# Altium schematic sheet bus-main.SchDoc: Top Level
size A4; DrawnBy: J. Reimer T. Yeung M. Au; Organization: UTAT SS; DocumentNumber: 1; Revision: 1.0; SheetNumber: 1; SheetTotal: 17
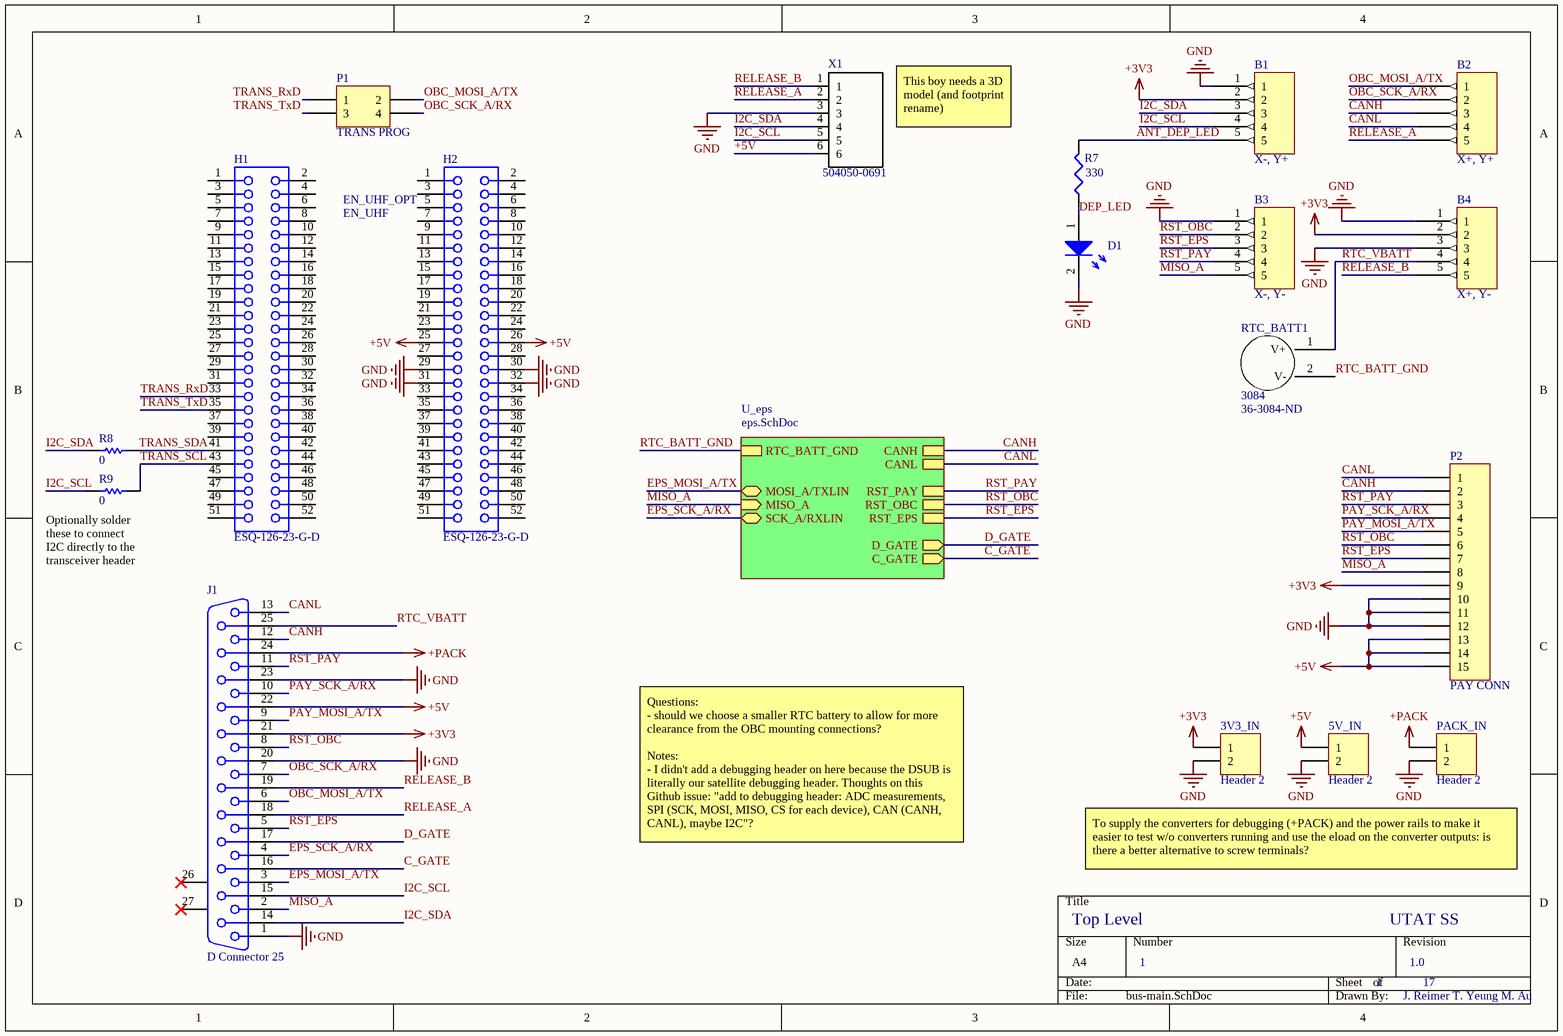
[diagram p0: bus-main.SchDoc]

## Parts
3V3_IN  Header 2  [CON2_SCREW_5.00MM_691102710002]
5V_IN  Header 2  [CON2_SCREW_5.00MM_691102710002]
B1  X-, Y+  [70AAJ-5-M0-ND]
B2  X+, Y+  [70AAJ-5-M0-ND]
B3  X-, Y-  [70AAJ-5-M0-ND]
B4  X+, Y-  [70AAJ-5-M0-ND]
D1  (no value)  [LED0603]
H1  ESQ-126-23-G-D  [SSW-126-01-G-D]
H2  ESQ-126-23-G-D  [SSW-126-01-G-D]
J1  D Connector 25  [Mini DSub Connector]
P1  TRANS PROG  [HDR2X2]
P2  PAY CONN  [DF13A-15P-1.25H(21)]
PACK_IN  Header 2  [CON2_SCREW_5.00MM_691102710002]
R7  330  [RES0402R]
R8  0  [1608[0603]]
R9  0  [1608[0603]]
RTC_BATT1  3084  Supplier Part Number 1: 36-3084-ND  [3084]
X1  504050-0691  [MOLEX_504050-0691]

## Sub-sheets
U_eps = eps.SchDoc: RST_PAY, RST_OBC, RST_EPS, SCK_A/RXLIN (bidir), MOSI_A/TXLIN (bidir), MISO_A (in), CANL, CANH, RTC_BATT_GND, D_GATE (out), C_GATE (out)

## Nets
+3V3: 3V3_IN.1 B1.2 B4.2 J1.21 P2.9
+5V: 5V_IN.1 H2.25 H2.26 J1.22 P2.13 P2.14 P2.15 X1.6
+PACK: J1.24 PACK_IN.1
GND: 3V3_IN.2 5V_IN.2 B1.1 B3.1 B4.1 B4.3 D1.2 H2.29 H2.30 H2.31 H2.32 J1.1 J1.20 J1.23 P2.10 P2.11 P2.12 PACK_IN.2 X1.3
ANT_DEP_LED: B1.5 R7.2
C_GATE: J1.16 ; sheet U_eps/C_GATE
CANH: B2.3 J1.12 P2.2 ; sheet U_eps/CANH
CANL: B2.4 J1.13 P2.1 ; sheet U_eps/CANL
D_GATE: J1.17 ; sheet U_eps/D_GATE
DEP_LED: D1.1 R7.1
EPS_MOSI_A/TX: J1.3 ; sheet U_eps/MOSI_A/TXLIN
EPS_SCK_A/RX: J1.4 ; sheet U_eps/SCK_A/RXLIN
I2C_SCL: B1.4 J1.15 R9.1 X1.5
I2C_SDA: B1.3 J1.14 R8.1 X1.4
MISO_A: B3.5 J1.2 P2.8 ; sheet U_eps/MISO_A
OBC_MOSI_A/TX: B2.1 J1.6 P1.2
OBC_SCK_A/RX: B2.2 J1.7 P1.4
PAY_MOSI_A/TX: J1.9 P2.5
PAY_SCK_A/RX: J1.10 P2.4
RELEASE_A: B2.5 J1.18 X1.2
RELEASE_B: B4.5 J1.19 X1.1
RST_EPS: B3.3 J1.5 P2.7 ; sheet U_eps/RST_EPS
RST_OBC: B3.2 J1.8 P2.6 ; sheet U_eps/RST_OBC
RST_PAY: B3.4 J1.11 P2.3 ; sheet U_eps/RST_PAY
RTC_BATT_GND: RTC_BATT1.2(V-) ; sheet U_eps/RTC_BATT_GND
RTC_VBATT: B4.4 J1.25 RTC_BATT1.1(V+)
TRANS_RxD: H1.33 P1.1
TRANS_SCL: H1.43 R9.2
TRANS_SDA: H1.41 R8.2
TRANS_TxD: H1.35 P1.3

Not connected (* = marked no-connect by the designer): H1 1 2 3 4 5 6 7 8 9 10 11 12 13 14 15 16 17 18 19 20 21 22 23 24 25 26 27 28 29 30 31 32 34 36 37 38 39 40 42 44 45 46 47 48 49 50 51 52; H2 1 2 3 4 5 6 7 8 9 10 11 12 13 14 15 16 17 18 19 20 21 22 23 24 27 28 33 34 35 36 37 38 39 40 41 42 43 44 45 46 47 48 49 50 51 52; J1 26(MH1)* 27(MH2)*

## Notes on the sheet
- This boy needs a 3D model (and footprint rename)
- EN_UHF
- EN_UHF_OPT
- (near R9) Optionally solder these to connect I2C directly to the transceiver header
- Questions:
  - should we choose a smaller RTC battery to allow for more clearance from the OBC mounting connections?
  Notes:
  - I didn't add a debugging header on here because the DSUB is literally our satellite debugging header. Thoughts on this Github issue: "add to debugging header: ADC measurements, SPI (SCK, MOSI, MISO, CS for each device), CAN (CANH, CANL), maybe I2C"?
- To supply the converters for debugging (+PACK) and the power rails to make it easier to test w/o converters running and use the eload on the converter outputs: is there a better alternative to screw terminals?

## Library data of the parts
3V3_IN 5V_IN PACK_IN = Header 2: Battery Header, 2-Pin; LatestRevisionDate: 17-Jul-2002; LatestRevisionNote: Re-released for DXP Platform.; Publisher: Altium Limited; Supplier 1: Digi-Key; Supplier Part Number 1: WM1351-ND
B1-B4 = 70AAJ-5-M0: Supplier 1: Digi-Key; Supplier Part Number 1: 70AAJ-5-M0-ND
D1 = LED: Just a generic LED
H1 H2 = ESQ-126-23-G-D: PC/104(TM) Elevated Socket Strip, Through-hole, Vertical, -55 to 125 degC, 2.54 mm Pitch, 52-Pin, Female, RoHS; Manufacturer: Samtec; Pitch: 2.54 mm; DatasheetVersion: F-214; PackageVersion: BZ, 9/1998; PackageReference: ESQ-126-23-X-D; PackageDescription: ESQ Strip ASM; Supplier 1: Newark; Supplier Part Number 1: 92P1348; Orientation: Vertical; RoHS: True; Temperature Range: -55 to 125 degC; Mounting Technology: Through-hole; PartNumber: ESQ-126-23-G-D; ComponentLink1Description: Manufacturer URL; ComponentLink1URL: http://www.samtec.com; ComponentLink2Description: Datasheet; ComponentLink2URL: http://www.samtec.com/documents/webfiles/pdf/ESQ_TH.PDF; ComponentLink3Description: Package Specification; ComponentLink3URL: http://www.samtec.com/documents/webfiles/cpdf/ESQ-1XX-XX-X-X-XXX-XX-X-XX-MKT.pdf
  H1: Supplier 2: Digi-Key; Supplier Part Number 2: ESQ-126-23-G-D-ND
J1 = D Connector 25: Receptacle Assembly, 25 Position, Right Angle; PackageDocument: U; Positions: 25; Published: 15-Jun-2001; LatestRevisionDate: 17-Jul-2002; LatestRevisionNote: Re-released for DXP Platform.; DatasheetDocument: 19-Mar-1999; PackageReference: 787202; Publisher: Altium Limited; Orientation: Right Angle; Gender: Receptacle; ComponentLink1Description: Mini-D25 - Molex, LLC 0836149012; ComponentLink1URL: https://www.digikey.ca/product-detail/en/molex-llc/0836149012/WM2144-ND/1867000; Supplier 1: Digi-Key; Supplier Part Number 1: WM2144-ND
P1 = Header 2X2: Header, 2-Pin, Dual row / For shorting transceiver pins together for testing/debugging; LatestRevisionDate: 17-Jul-2002; LatestRevisionNote: Re-released for DXP Platform.; Publisher: Altium Limited
P2 = Header 15: Header, 15-Pin; LatestRevisionDate: 17-Jul-2002; LatestRevisionNote: Re-released for DXP Platform.; Publisher: Altium Limited; Supplier 1: Digi-Key; Supplier Part Number 1: WM7632CT-ND
R7 = Res3: Resistor; Published: 8-Jun-2000; LatestRevisionDate: 29-May-2009; LatestRevisionNote: IPC-7351 Footprint Added.; PackageReference: J1-0603; Publisher: Altium Limited; PackageDescription: Chip Resistor; Value: 330
R8 R9 = Res1: (Optional) for connecting I2C to the transceiver; Published: 8-Jun-2000; LatestRevisionDate: 17-Jul-2002; LatestRevisionNote: Re-released for DXP Platform.; PackageReference: AXIAL-0.3; Publisher: Altium Limited; PackageDescription: Axial Device, Thru-Hole; 2 Leads; 0.3 in Pin Spacing; Value: 0
  R8: Supplier 1: Digi-Key; Supplier Part Number 1: 311-0.0GRDKR-ND
RTC_BATT1 = 3084: CR2330 Battery Holder; Manufacturer: Keystone Electronics; Number of Batteries: 2; Number of Cells: 1; Supplier 1: Digi-Key; Manufacturer Part Number: 3084; Stock 1: 658; Pricing 1: 1=0.62, 10=0.523, 50=0.4586, 250=0.39796, 500=0.391, 1000=0.34946, 2500=0.31916, 5000=0.29492 (USD); Mount: Surface Mount,PCB; Case/Package: SMD/SMT; Package Quantity: 100; Termination: SMD/SMT; Lead Free: Lead Free; REACH SVHC: No SVHC; ComponentLink1URL: http://media.digikey.com/pdf/Data%20Sheets/Keystone%20Electronics%20PDFs/Lithium_Coin_Cell_Retainers_SMT.pdf?src-supplier=Digi-Key; ComponentLink1Description: http://media.digikey.com/pdf/Data%20Sheets/Keystone%20Electronics%20PDFs/Lithium_Coin_Cell_Retainers_SMT.pdf?src-supplier=Digi-Key
X1 = 504050-0691: Wire-To-Board Connector, Pico-Lock 504050 Series, Surface Mount, Header, 6, 1.5 mm